# Altium schematic sheet ADC_Logic.SchDoc
size 431 x 279 mm; Organization: ORGANIZATION; Address1: ADDRESS 1; Address2: ADDRESS 2; Address3: ADDRESS 3; Address4: ADDRESS 4; Revision: -; SheetNumber: 4; SheetTotal: 4; ENG_APP_DATE: --/--/--; DSN_APP_DATE: --/--/--; CHK_APP_DATE: --/--/--
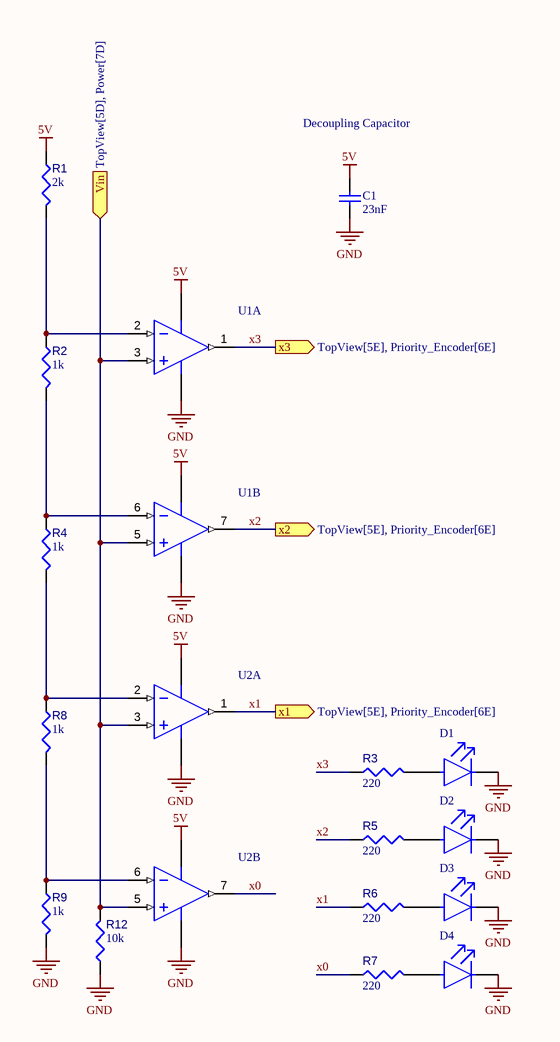
[diagram p0: ADC_Logic.SchDoc]

## Parts
C1  23nF  [KEMT-C315-THT-2]
D1  LTL2P3KGKNN  [FP-LTL2P3KGKNN-MFG]  (value not drawn)
D2  LTL2P3KGKNN  [FP-LTL2P3KGKNN-MFG]  (value not drawn)
D3  LTL2P3KGKNN  [FP-LTL2P3KGKNN-MFG]  (value not drawn)
D4  LTL2P3KGKNN  [FP-LTL2P3KGKNN-MFG]  (value not drawn)
R1  value 2k  [RESA60-630X240]  (hidden comment: MFR-25FBF52-100R)
R2  value 1k  [RESA60-630X240]  (hidden comment: MFR-25FBF52-100R)
R3  value 220  [RESA60-630X240]  (hidden comment: MFR-25FBF52-100R)
R4  value 1k  [RESA60-630X240]  (hidden comment: MFR-25FBF52-100R)
R5  value 220  [RESA60-630X240]  (hidden comment: MFR-25FBF52-100R)
R6  value 220  [RESA60-630X240]  (hidden comment: MFR-25FBF52-100R)
R7  value 220  [RESA60-630X240]  (hidden comment: MFR-25FBF52-100R)
R8  value 1k  [RESA60-630X240]  (hidden comment: MFR-25FBF52-100R)
R9  value 1k  [RESA60-630X240]  (hidden comment: MFR-25FBF52-100R)
R12  10k  [RESA60-630X240]
U1  LM358N/NOPB  [P0008A]  (value not drawn)  (parts A,B of 2)
U2  LM358N/NOPB  [P0008A]  (value not drawn)  (parts A,B of 2)

## Ports
Vin (in, see TopView[5D], Power[7D]), x1 (out, see TopView[5E], Priority_Encoder[6E]), x2 (out, see TopView[5E], Priority_Encoder[6E]), x3 (out, see TopView[5E], Priority_Encoder[6E])

## Nets
5V: C1.2 R1.1 U1.8(V+) U2.8(V+)
GND: C1.1 D1.1(C) D2.1(C) D3.1(C) D4.1(C) R9.2 R12.1 U1.4(GND) U2.4(GND)
Vin: R12.2 U1.3(INA+) U1.5(INB+) U2.3(INA+) U2.5(INB+) ; port Vin
x0: R7.1 U2.7(OUTB)
x1: R6.1 U2.1(OUTA) ; port x1
x2: R5.1 U1.7(OUTB) ; port x2
x3: R3.1 U1.1(OUTA) ; port x3
NetD1_2: D1.2(A) R3.2
NetD2_2: D2.2(A) R5.2
NetD3_2: D3.2(A) R6.2
NetD4_2: D4.2(A) R7.2
NetR1_2: R1.2 R2.1 U1.2(INA-)
NetR2_2: R2.2 R4.1 U1.6(INB-)
NetR4_2: R4.2 R8.1 U2.2(INA-)
NetR8_2: R8.2 R9.1 U2.6(INB-)

## Notes on the sheet
- Decoupling Capacitor
- DWG. NO.
- REV.
- SHT.
- THIS DOCUMENT AND THE DATA DISCLOSED HEREIN OR HEREWITH IS THE PROPERTY OF ALTIUM LIMITED AND MAY BE FREELY DISTRIBUTED IN WHOLE. NO RIGHTS ARE RESERVED OR EXPRESS OR IMPLIED WARANTEE GIVEN.
- REVISION
- DESCRIPTION
- DATE
- APPROVED
- ENG:
- APPROVALS
- PROJECT
- DSN:
- CHK:
- REFERENCE DOCUMENTS
- PROJECT REVISION:
- TITLE
- DOCUMENT REVISION:
- DESIGN ITEM:
- BOM:
- FAB DWG:
- PCB DWG:
- ASSY DWG:
- SCALE:
- SIZE
- B
- CAGE CODE
- FILE NAME
- DWG NO.
- SHEET
- OF
- REV

## Library data of the parts
C1 = CMP-1664-00007-1: Capacitor, Ceramic, 0.01 uF, +/- 10%, 100 V, X7R, -55 to 125 degC, 2-Pin THD, RoHS, Bulk; Output Voltage: 70 V; Case\Package: PDIP; Forward Current: 60 mA; Nominal Vf: 1.3 V; Forward Voltage: 1.5 V; Channels: 2; Max Power Dissipation: 400 mW; Vce Max: 500 mV; ComponentLink1Description: Manufacturer URL; ComponentLink2Description: Datasheet; Packaging: Rail/Tube; RoHSCompliant: true; Package Quantity: 2000; PackageReference: C315-THT-2; Min Operating Temperature: -55 degC; Max Operating Temperature: 100 degC; Radiation Hardening: No; ComponentLink1URL: http://www.kemet.com/; DatasheetVersion: Aug-16; Pins: 16; PackageDescription: 2-Pin Through Hole Device, Body 3.81 x 2.54 mm; REACH SVHC: Unknown; Mount: Through Hole; ComponentLink2URL: http://capacitoredge.kemet.com/capedge2/DataSheet/Datasheet-C315C103K1R5TA.pdf?pn=C315C103K1R5TA{BULK}
D1-D4 = CMP-22017-000002-1: LED GREEN CLEAR T-1 3/4 T/H; Manufacturer: Lite-On; Forward Voltage: 2.1V; Led Orientation: Straight; Forward Current: 20mA; Luminous Intensity: 980mcd; Wavelength: 572nm; Power Dissipation: 75mW; Peak Emmision Wavelength: 575nm; Viewing Angle: 22°; Reverse Voltage: 5V; Category: Diode; Temperature Range Low: -40°C; Device Class L1: Optoelectronics; Temperature: -40°C to +100°C; Mouser Description: LED Uni-Color Green 575nm 2-Pin T-1 3/4; Height: 9.95mm; Package: 0; Colour: Green; ComponentLink2Description: Datasheet; Digikey Description: LED GREEN CLEAR T-1 3/4 T/H; Automotive: No; Lead Free: Yes; ComponentLink2URL: https://optoelectronics.liteon.com/upload/download/DS20-2000-193/LTL2P3KGKNN.pdf; Manufacturer Part Number: LTL2P3KGKNN; Temperature Range High: +100°C; RoHS: TRUE; Device Class L2: LEDs; Device Class L3: unset; Octopart: https://octopart.com/ltl2p3kgknn-lite-on-550036
R1-R9 R12 = CMP-009-00046-4: Axial Resistor, 100 Ohm, +/- 1%, 0.25 W, -55 to 155 degC, 2-Pin THD, RoHS, Bulk; Manufacturer: Yageo; Voltage Rating: 250V; Power: 250mW; Packaging: Bulk; Max Operating Temperature: 155°C; Mounting Technology: TH; Datasheet Version: Apr-13; Case/Package: Axial; RoHS Compliant: True; Package Description: 2-Pin Axial Lead, Dia 2.4 mm, Body Length 6.3 mm; Package Quantity: 200; Package Reference: MFR-25; Tolerance: 1%; Composition: CarbonFilm; Datasheet URL: http://www.yageo.com/documents/recent/Yageo%20LR_MFR_2013.pdf; Manufacturer URL: http://www.yageo.com/; Min Operating Temperature: -55°C
  R12: Value: 10k
U1 U2 = CMP-0055-00153-3: Low Power Dual Operational Amplifier, 8-pin MDIP, Pb-Free; Manufacturer: Texas Instruments; PowerWise: N; PackageTopMarking: NSUZXYTTE#*LM*358N; CompType: Amplifiers; Package Reference: P0008A; PinCount: 8; ComponentLink1URL: http://www.ti.com/general/docs/lit/getliterature.tsp?genericPartNumber=LM358-N&fileType=pdf; Code_JEDEC: MS-001-BA; PackageDescription: MDIP, .365 x .250 x .130in, 8 Lead, .100in Pitch; RoHS: Y; ComponentLink1Description: Datasheet URL